# EAGLE design tilt_soms_lgbu_v3 (EAGLE 9.0.1)
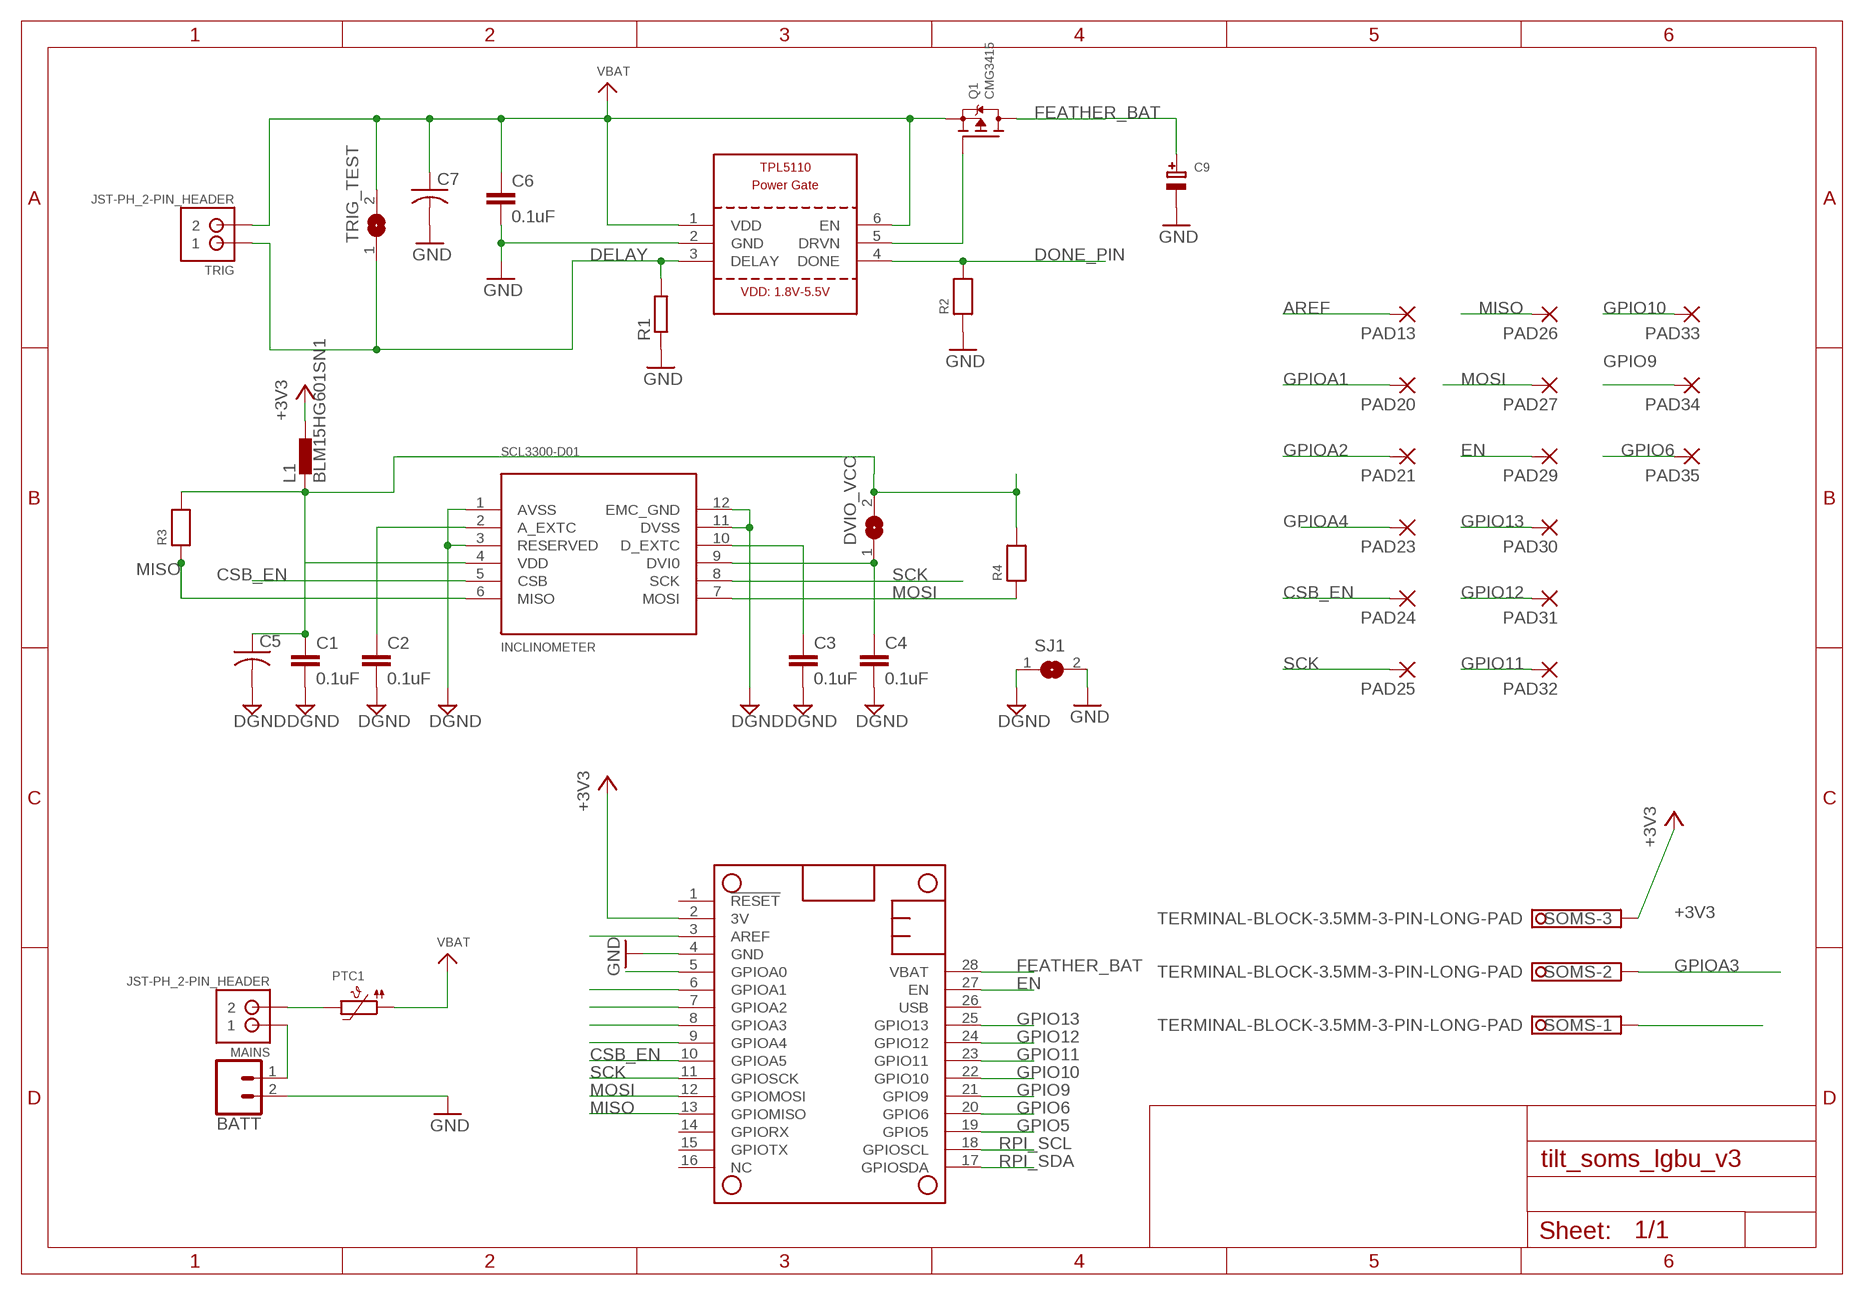
[diagram p0: schematic, sheet 1]

## Parts
BATT  CONN_02POLAR_LOCK  [MOLEX-1X2_LOCK]
C1  0.1uF  C-EUC0402  [C0402]
C2  0.1uF  C-EUC0402  [C0402]
C3  0.1uF  C-EUC0402  [C0402]
C4  0.1uF  C-EUC0402  [C0402]
C5  C-USC1206K  [C1206K]
C6  0.1uF  C-EUC0402  [C0402]
C7  C-USC1206K  [C1206K]
C9  CAP_TANTALUMA/3216_WAVE  [EIA3216-18/A-W]
DVIO_VCC  SOLDERJUMPER  [SOLDERJUMPER_ARROW_NOPASTE]
INCLINOMETER  SCL3300-D01  [SCL3300-D01]
L1  BLM15HG601SN1  [0402]
MAINS  JST-PH_2-PIN_HEADER  [JST_B2B-PH_HEADER]
MS2  FEATHERWINGFEATHERWING_EDC  [FEATHERWING_NODIM_HOLES_2]
PAD13  WIREPADSMD1,27-254  [SMD1,27-2,54]
PAD20  WIREPADSMD1,27-254  [SMD1,27-2,54]
PAD21  WIREPADSMD1,27-254  [SMD1,27-2,54]
PAD23  WIREPADSMD1,27-254  [SMD1,27-2,54]
PAD24  WIREPADSMD1,27-254  [SMD1,27-2,54]
PAD25  WIREPADSMD1,27-254  [SMD1,27-2,54]
PAD26  WIREPADSMD1,27-254  [SMD1,27-2,54]
PAD27  WIREPADSMD1,27-254  [SMD1,27-2,54]
PAD29  WIREPADSMD1,27-254  [SMD1,27-2,54]
PAD30  WIREPADSMD1,27-254  [SMD1,27-2,54]
PAD31  WIREPADSMD1,27-254  [SMD1,27-2,54]
PAD32  WIREPADSMD1,27-254  [SMD1,27-2,54]
PAD33  WIREPADSMD1,27-254  [SMD1,27-2,54]
PAD34  WIREPADSMD1,27-254  [SMD1,27-2,54]
PAD35  WIREPADSMD1,27-254  [SMD1,27-2,54]
PTC1  PTC1210  [PTC1210]
Q1  CMG3415  MOSFET-PWIDE  [SOT23-WIDE]
R1  R-EU_0207/10  [0207/10]
R2  RESISTOR0805  [0805]
R3  RESISTOR0805  [0805]
R4  RESISTOR0805  [0805]
SJ1  SJ  [SJ]
SOMS  TERMINAL-BLOCK-3.5MM-3-PIN-LONG-PAD  [TERMINAL-BLOCK-3-PIN-3.5MM-LONG-PAD]
TIMER  TPL5110  [SOT23-6]
TRIG  JST-PH_2-PIN_HEADER  [JST_B2B-PH_HEADER]
TRIG_TEST  SOLDERJUMPER  [SOLDERJUMPER_ARROW_NOPASTE]

## Nets
+3V3: L1.2 MS2.2(3V) SOMS.3
AREF: MS2.3(AREF) PAD13.1(P)
CSB_EN: INCLINOMETER.5(CSB) MS2.10(GPIOA5) PAD24.1(P)
DELAY: R1.2 TIMER.3(DELAY) TRIG.P1 TRIG_TEST.1
DGND: C1.2 C2.2 C3.2 C4.2 C5.2 INCLINOMETER.1(AVSS) INCLINOMETER.3(RESERVED) INCLINOMETER.11(DVSS) INCLINOMETER.12(EMC_GND) SJ1.1
DONE_PIN: MS2.5(GPIOA0) R2.2 TIMER.4(DONE)
EN: MS2.27(EN) PAD29.1(P)
FEATHER_BAT: C9.+ MS2.28(VBAT) Q1.3(D)
GND: BATT.2 C6.2 C7.2 C9.- MS2.4(GND) R1.1 R2.1 SJ1.2 SOMS.1 TIMER.2(GND)
GPIO5: MS2.19(GPIO5)
GPIO6: MS2.20(GPIO6) PAD35.1(P)
GPIO9: MS2.21(GPIO9) PAD34.1(P)
GPIO10: MS2.22(GPIO10) PAD33.1(P)
GPIO11: MS2.23(GPIO11) PAD32.1(P)
GPIO12: MS2.24(GPIO12) PAD31.1(P)
GPIO13: MS2.25(GPIO13) PAD30.1(P)
GPIOA1: MS2.6(GPIOA1) PAD20.1(P)
GPIOA2: MS2.7(GPIOA2) PAD21.1(P)
GPIOA3: MS2.8(GPIOA3) SOMS.2
GPIOA4: MS2.9(GPIOA4) PAD23.1(P)
MISO: INCLINOMETER.6(MISO) MS2.13(GPIOMISO) PAD26.1(P) R3.1
MOSI: INCLINOMETER.7(MOSI) MS2.12(GPIOMOSI) PAD27.1(P) R4.1
N$1: C2.1 INCLINOMETER.2(A_EXTC)
N$2: C3.1 INCLINOMETER.10(D_EXTC)
N$3: BATT.1 MAINS.P1
N$4: MAINS.P2 PTC1.P$2
N$5: C4.1 DVIO_VCC.1 INCLINOMETER.9(DVI0)
N$6: Q1.1(G) TIMER.5(DRVN)
N$7: C1.1 C5.1 DVIO_VCC.2 INCLINOMETER.4(VDD) L1.1 R3.2 R4.2
RPI_SCL: MS2.18(GPIOSCL)
RPI_SDA: MS2.17(GPIOSDA)
SCK: INCLINOMETER.8(SCK) MS2.11(GPIOSCK) PAD25.1(P)
VBAT: C6.1 C7.1 PTC1.P$1 Q1.2(S) TIMER.1(VDD) TIMER.6(EN) TRIG.P2 TRIG_TEST.2
Unconnected: MS2.1(!RESET) MS2.14(GPIORX) MS2.15(GPIOTX) MS2.16(NC) MS2.26(USB)

## Library data of the parts
BATT = SparkFun-Connectors:CONN_02: Multi connection point. Often used as Generic Header-pin footprint for 0.1 inch spaced/style header connections On any of the 0.1 inch spaced packages, you can populate with these: Break Away Headers - Straight <https://www.sparkfun.com/products/116> (PRT-00116) Break Away Male Headers - Right Angle <https://www.sparkfun.com/products/553> (PRT-00553) Female Headers <https://www.sparkfun.com/products/115> (PRT-00115) Break Away Headers - Machine Pin <https://www.sparkfun.com/products/117> (PRT-00117) Break Away Female Headers - Swiss Machine Pin <https://www.sparkfun.com/products/743> (PRT-00743) For SCREWTERMINALS and SPRING TERMINALS visit here: Screw Terimnals on SparkFun.com <https://www.sparkfun.com/search/results?term=Screw+Terminals> (5mm/3.5mm/2.54mm spacing) This device is also useful as a general connection point to wire up your design to another part of your project. Our various solder wires solder well into these plated through hole pads. Hook-Up Wire - Assortment (Stranded, 22 AWG) <https://www.sparkfun.com/products/11375> (PRT-11375) Hook-Up Wire - Assortment (Solid Core, 22 AWG) <https://www.sparkfun.com/products/11367> (PRT-11367) View the entire wire category on our website here <https://www.sparkfun.com/categories/141> Special notes: Molex polarized connector foot print use with: PRT-08233 with associated crimp pins and housings. 2.54_SCREWTERM for use with PRT-10571. 3.5mm Screw Terminal footprints for PRT-08084 5mm Screw Terminal footprints for use with PRT-08432; SF_ID: PRT-09918
C1-C4 C6 = rcl:C-EU: CAPACITOR, European symbol; SPICEPREFIX: C
C5 C7 = rcl:C-US: CAPACITOR, American symbol
C9 = microbuilder:CAP_TANTALUM: Tantalum Capacitors Wave footprints have larger pads and are meant to be used for hand soldering. Reflow footprints are optimised for solder paste and a reflow oven. EIA3216-18/A-[R/W] - Size A / 3216-18 / 1206 footprint 4.7µF 25V 10% Tantalum Capacitor 10µF 16V 10% Tantalum Capacitor [Digikey: 495-2236-2-ND] EIA3528-21/B-[R/W] - Size B / 3528-21 47µF 10V 10% Tantalum Capactior [Digikey: 495-2216-1-ND] EIA6032-28/C-[R/W] - Size C / 6032-28 10µF 35V 20% Tantalum Capacitor [Digikey: 495-2285-1-ND] 100µF 16V 10% Tantalum Capactior [Digikey: 399-5214-1-ND]
DVIO_VCC TRIG_TEST = microbuilder:SOLDERJUMPER: SMD Solder JUMPER Solder the two pads together to create a connection, or remove the solder to break it. REFLOW - Use this footprint for solder paste and reflow ovens. WAVE - Use this footprint for hand-soldering (larger pads). CLOSED - Has a trace between the two pads to ensure it is closed by default. The trace needs to be cut to disable the jumper, and can be closed again by creating a solder bridge between the two pads.; BOM: EXCLUDE
INCLINOMETER = edc_modules:SCL3300-D01
L1 = inductors:BLM15H: EMIFIL (R) Chip Ferrite Bead for GHz Noise Source: http://www.murata.com/ Ferrite Bead BLM15H.pdf
MAINS TRIG = SRG:JST-PH_2-PIN_HEADER: 2-pin JST PH Shrouded Header, top entry P/N B2B-PH-K-S Mating connector PHR-2 Mating cable assembly: Sparkfun PRT-09914 <http://www.sparkfun.com/products/9914>
MS2 = adafruit:FEATHERWING
PAD13 PAD20 PAD21 PAD23-PAD27 PAD29-PAD35 = wirepad:WIREPAD: Wire PAD connect wire on PCB
PTC1 = microbuilder:PTC: PTC (Resettable Fuse) 1206 Package 250mA PTC (16V Max, Time-to-Trip: 0.08s) - Digikey: F2110CT-ND 1210 Package 100mA PTC (30V Max, Time-to-Trip: 0.6s) - Digikey: MF-USMF010-2CT-ND 1812 Package 750mA PTC (24V Max, Time-to-Trip: 0.2s) - Digikey: MF-MSMF075/24-2CT-ND
Q1 = microbuilder:MOSFET-P: P-Channel Mosfet LEGEND VDS: Voltage Drain-Source ID: Drain Current RDS(ON): Drain-Source On-State Resistance VGS(TH): Gate-Source Threshold Voltage CISS: Drain-Source Input Capacitance SOT-23 Name VDS ID RDS(ON) VGS(TH) CISS Order Number IRLML5103 30V 760mA 600 mOhm -- 75pF @ 25V Digikey: IRLML5103PBFCT-ND IRLML6401 12V 4.3A 50 mOhm 950mV @ 250µA 830pF @ 10V Digikey: IRLML6401PBFTR-ND NTR0202PL 20V 400mA 800 mOhm 2.3V @ 250uA 70pF @ 5V Digikey: NTR0202PLT1GOSTR-ND NTR4101PT1G 20V 1.8A 85 mOhm 1.2V @ 250uA 675pF @ 10V Digikey: NTR4101PT1GOSCT-ND DMP2004K 20V 600mA 900 mOhm 1V @ 250uA 175pF @ 16V Digikey: DMP2004KDICT-ND PMV65XP 20V 3.9A 76 mOhm 950mV @ 1mA 725pF @ 20V Digikey: 568-2358-2-ND TO-252 Name VDS ID RDS(ON) VGS(TH) CISS Order Number AOD417 30V 25A 34 mOhm 3V @ 250µA 920pF @ 15V Digikey: 785-1106-2-ND
R1 = rcl:R-EU_: RESISTOR, European symbol
R2-R4 = microbuilder:RESISTOR: Resistors 0402 - 0402 Surface Mount Package 22 Ohm 1% 1/16W [Digikey: 311-22.0LRTR-ND] 33 Ohm 5% 1/16W 1.0K 5% 1/16W 1.5K 5% 1/16W 2.0K 1% 1/16W 10.0K 1% 1/16W [Digikey: 311-10.0KLRTR-ND] 10.0K 5% 1/16W [Digikey: RMCF0402JT10K0TR-ND] 12.1K 1% 1/16W [Digikey: 311-22.0LRTR-ND] 100.0K 5% 1/16W 0603 - 0603 Surface Mount Package 0 Ohm 1/10 Watt 1% Resistor 15 Ohm 1/10 Watt 1% Resistor 33 Ohm 1/10 Watt 1% Resistor 49.9 Ohm 1/10 Watt 1% Resistor 100 Ohm 1/10 Watt 1% Resistor 150 Ohm 1/10 Watt 1% Resistor 240 Ohm 1/10 Watt 1% Resistor 390 Ohm 1/10 Watt 1% Resistor 560 Ohm 1/10 Watt 1% Resistor 680 Ohm 1/10 Watt 1% Resistor 750 Ohm 1/10 Watt 1% Resistor 1.0K Ohm 1/10 Watt 1% Resistor 1.5K Ohm 1/10 Watt 1% Resistor 2.0K Ohm 1/10 Watt 1% Resistor 2.2K Ohm 1/10 Watt 1% Resistor 3.3K Ohm 1/10 Watt 1% Resistor 4.7K Ohm 1/10 Watt 1% Resistor 10.0K Ohm 1/10 Watt 1% Resistor 12.0K Ohm 1/10 Watt 1% Resistor 12.1K Ohm 1/10 Watt 1% Resistor 20.0K Ohm 1/10 Watt 1% Resistor 33.0K Ohm 1/10 Watt 1% Resistor 100.0K Ohm 1/10 Watt 1% Resistor 0805 - 0805 Surface Mount Package 0 Ohm 1/8 Watt 1% Resistor 33 Ohm 1/8 Watt 1% Resistor 100 Ohm 1/8 Watt 1% Resistor 150 Ohm 1/8 Watt 1% Resistor 200 Ohm 1/8 Watt 1% Resistor 240 Ohm 1/8 Watt 1% Resistor 330 Ohm 1/8 Watt 1% Resistor 390 Ohm 1/8 Watt 1% Resistor 470 Ohm 1/8 Watt 1% Resistor 1.0K Ohm 1/8 Watt 1% Resistor 1.5K Ohm 1/8 Watt 1% Resistor 2.0K Ohm 1/8 Watt 1% Resistor 4.7K Ohm 1/8 Watt 1% Resistor 5.1K Ohm 1/8 Watt 1% Resistor 5.6K Ohm 1/8 Watt 1% Resistor 10.0K Ohm 1/8 Watt 1% Resistor 22.0K Ohm 1/8 Watt 1% Resistor 33.0K Ohm 1/8 Watt 1% Resistor 100K Ohm 1/8 Watt 1% Resistor 1206 - 1206 Surface Mount Package 2012 - 2010 Surface Mount Package 0.11 Ohm 1/2 Watt 1% Resistor - Digikey: RHM.11UCT-ND
SJ1 = jumper:SJ: SMD solder JUMPER
SOMS = Rembrandt Electronics - Terminal Block 3-5mm v1-0:TERMINAL-BLOCK-3.5MM-3-PIN: Terminal Block 3.5mm Pitch: 3,5 mm Number of pins: 3 Created by Rembrandt Electronics www.rembrandtelectronics.com
TIMER = edc_modules:TPL5110

## Board
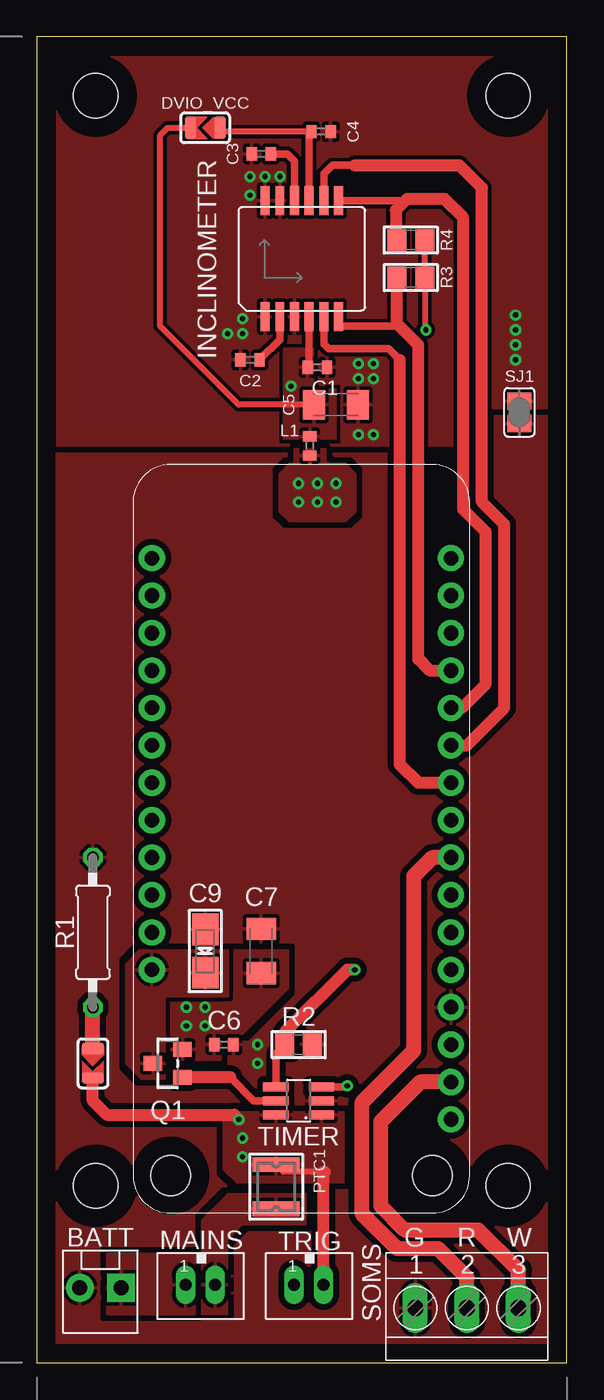
[diagram p1: board, top side]
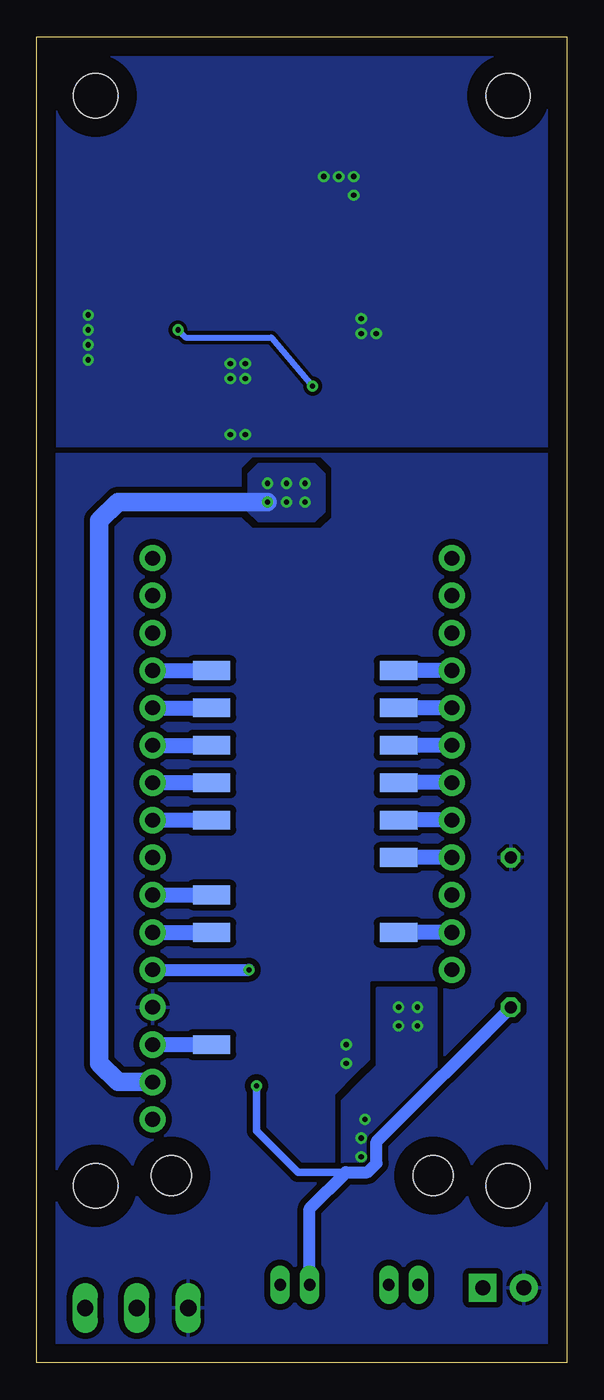
[diagram p2: board, bottom side, seen from below]

Size 36 x 90 mm. Coordinates in mm from the lower left corner, seen from the top.
Outline: 36,90 0,90 0,0 36,0 36,90
Copper layers (1*16): Top 0.035mm / dielectric 1.5mm / Bottom 0.035mm
Design rules "default *": minimum track width 8mil, minimum drill 0.35mm, track to track 10mil, track to pad 10mil, pad to pad 10mil, via to via 10mil, smd to smd 6mil, copper to edge 50mil, drill to drill 10mil, minimum pad ring 10mil, minimum via ring 8mil, stop-mask expansion 4mil, vias tented up to drill 0mil, thermal gap 10mil
Holes 3 mm at 32,12 4,12 32,86 4,86

### Footprints (pad centres in the part's own frame; a part is rotated, then mirrored left to right if it is on the bottom)
MOLEX-1X2_LOCK = drill 1.016 pad 1.88 square: 1 -0.127,0 | drill 1.016 pad 1.88: 2 2.667,0
C0402 = smd 0.7 x 0.9: 1 -0.65,0; 2 0.65,0
C1206K = smd 1.5 x 2: 1 -1.5,0; 2 1.5,0
EIA3216-18/A-W = smd 2.15 x 1.8: + 1.475,0; - -1.475,0
SOLDERJUMPER_ARROW_NOPASTE = smd 0.762 x 1.524: 1 -1.016,0; 2 1.016,0
SCL3300-D01 = smd 0.61 x 1.96: 1 -2.5,-3.935; 2 -1.5,-3.935; 3 -0.5,-3.935; 4 0.5,-3.935; 5 1.5,-3.935; 6 2.5,-3.935; 7 2.5,3.935; 8 1.5,3.935; 9 0.5,3.935; 10 -0.5,3.935; 11 -1.5,3.935; 12 -2.5,3.935
0402 = smd 0.7 x 0.9: 1 -0.65,0; 2 0.65,0
JST_B2B-PH_HEADER = drill 0.8 long: P1 1.075,0.048; P2 -0.925,0.048
FEATHERWING_NODIM_HOLES_2 = drill 1 pad 1.778: 1 6.35,1.27; 2 8.89,1.27; 3 11.43,1.27; 4 13.97,1.27; 5 16.51,1.27; 6 19.05,1.27; 7 21.59,1.27; 8 24.13,1.27; 9 26.67,1.27; 10 29.21,1.27; 11 31.75,1.27; 12 34.29,1.27; 13 36.83,1.27; 14 39.37,1.27; 15 41.91,1.27; 16 44.45,1.27; 17 44.45,21.59; 18 41.91,21.59; 19 39.37,21.59; 20 36.83,21.59; 21 34.29,21.59; 22 31.75,21.59; 23 29.21,21.59; 24 26.67,21.59; 25 24.13,21.59; 26 21.59,21.59; 27 19.05,21.59; 28 16.51,21.59 | hole 2.7: 2.54,20.32; 2.54,2.54
SMD1,27-2,54 = smd 1.27 x 2.54: 1 0,0
PTC1210 = smd 1 x 3.2: P$1 -1.5,0; P$2 1.5,0
SOT23-WIDE = smd 1 x 1.27: 1 -0.95,-1; 2 0.95,-1; 3 0,1
0207/10 = drill 0.813 octagon: 1 -5.08,0; 2 5.08,0
0805 = smd 1.3 x 1.5: 1 -0.95,0; 2 0.95,0
SJ = smd 1.168 x 1.6: 1 -0.762,0; 2 0.762,0
TERMINAL-BLOCK-3-PIN-3.5MM-LONG-PAD = drill 1.1 pad 1.7 long: 1 -3.5,-0.1; 2 0,-0.1; 3 3.5,-0.1
SOT23-6 = smd 0.6 x 1.7: 1 -0.95,-1.55; 2 0,-1.55; 3 0.95,-1.55; 4 0.95,1.55; 5 0,1.55; 6 -0.95,1.55

### Placement (x,y rotation side)
BATT  5.59,5.08 180 top
C1  19.05,67.56 0 top
C2  14.48,68.07 180 top
C3  15.24,82.04 180 top
C4  19.3,83.57 0 top
C5  20.32,65.02 0 top
C6  12.7,21.59 0 top
C7  15.24,27.94 90 top
C9  11.43,27.94 270 top
DVIO_VCC  11.43,83.82 180 top
INCLINOMETER  18,74.93 0 top
L1  18.54,62.23 270 top
MAINS  11.18,5.33 180 top
MS2  29.4,10.16 90 top
PAD13  24.13,21.59 270 bottom
PAD20  24.13,29.21 90 bottom
PAD21  24.13,31.75 90 bottom
PAD23  24.13,36.83 90 bottom
PAD24  24.13,39.37 90 bottom
PAD25  24.13,41.91 90 bottom
PAD26  24.13,46.99 90 bottom
PAD27  24.13,44.45 90 bottom
PAD29  11.43,29.21 90 bottom
PAD30  11.43,34.29 90 bottom
PAD31  11.43,36.83 90 bottom
PAD32  11.43,39.37 90 bottom
PAD33  11.43,41.91 90 bottom
PAD34  11.43,44.45 90 bottom
PAD35  11.43,46.99 90 bottom
PTC1  16.26,11.94 270 top
Q1  8.89,20.32 90 top
R1  3.81,29.21 270 top
R2  17.78,21.59 180 top
R3  25.4,73.66 0 top
R4  25.4,76.2 0 top
SJ1  32.77,64.52 270 top
SOMS  29.21,3.81 0 top
TIMER  17.78,17.78 90 top
TRIG  18.54,5.33 180 top
TRIG_TEST  3.81,20.32 270 top

### Tracks (layer width: path | path; a pad name or v marks a point on that pad's centre or on a via)
+3V3  (via drill 0.35)
  Top 1.016: SOMS.3 32.71,6.29 30,9 25,9 23.36,10.63 23.36,16.36 26.05,19.05 MS2.2
  Bottom 1.27: MS2.2 30.48,19.05 31.75,20.32 31.75,57.15 30.48,58.42 27.69,58.42 v20.32,58.42
  other vias: 20.32,59.69 19.05,59.69 19.05,58.42 17.78,59.69 17.78,58.42
  pour Top: 20.95,57.15 17.14,57.15 16.51,57.78 16.51,60.33 17.14,60.96 17.53,60.96 17.53,61.98 18.98,61.98 19.56,61.98 19.56,61.21 19.81,60.96 20.95,60.96 21.59,60.33 21.59,57.78
  pour Bottom: 20.95,57.15 17.14,57.15 16.51,57.78 16.51,60.33 17.14,60.96 20.95,60.96 21.59,60.33 21.59,57.78
AREF
  Bottom 1.016: MS2.3 PAD13.1
CSB_EN
  Top 0.406: INCLINOMETER.5 19.5,70.16
  Top 0.508: 19.5,70.16 19.5,69.15 19.81,68.83 23.88,68.83 24.64,68.07
  Top 0.813: MS2.10 25.91,39.37 24.64,40.64 24.64,68.07
  Bottom 1.016: MS2.10 PAD24.1
DELAY  (via drill 0.35)
  Top 0.508: TIMER.3 21.02,18.73 v21.08,18.8
  Top 1.016: TRIG_TEST.1 R1.2
  Bottom 0.508: 15.01,12.93 18.27,12.93 21.08,15.75 v21.08,18.8
  Bottom 0.813: TRIG.P1 17.47,10.47 15.01,12.93 13.54,12.93 12.93,13.54 12.93,15.01 R1.2
DGND  (via drill 0.35)
  other vias: 13.97,69.85 12.95,69.85 13.97,70.87 21.84,67.82 22.86,67.82 21.84,66.8 22.86,66.8 32.51,71.12 32.51,68.07 32.51,69.09 32.51,70.1 16.51,80.52 15.49,80.52 14.48,80.52 14.48,79.25 21.84,62.99 22.86,62.99
  pour Bottom (rank 3): 1.27,88.9 34.8,88.9 34.8,62.23 1.27,62.23
  pour Top (rank 3): 34.8,64.77 30.48,64.77 30.48,62.23 1.27,62.23 1.27,88.9 34.8,88.9
DONE_PIN  (via drill 0.35)
  Top 0.508: 16.63,21.39 R2.2 16.23,20.99 TIMER.4
  Top 0.813: R2.2 16.83,22.42 21.08,26.67 v21.59,26.67
  Bottom 0.813: MS2.5 v21.59,26.67
EN
  Bottom 1.016: MS2.27 PAD29.1
FEATHER_BAT
  pour Top: 12.95,27.94 12.95,24.89 8.64,24.89 8.64,19.3 7.11,19.3 6.1,20.32 6.1,27.05 6.99,27.94
GND  (via drill 0.35)
  other vias: 14.99,20.32 14.99,21.59
  pour Bottom (isolate 0.406, rank 6): 36,90 0,90 0,0 36,0
  pour Top (isolate 0.406, rank 6): 36,90.06 0,90 0,0 36,0
GPIO6
  Bottom 1.016: MS2.20 PAD35.1
GPIO9
  Bottom 1.016: MS2.21 PAD34.1
GPIO10
  Bottom 1.016: MS2.22 PAD33.1
GPIO11
  Bottom 1.016: MS2.23 PAD32.1
GPIO12
  Bottom 1.016: MS2.24 PAD31.1
GPIO13
  Bottom 1.016: MS2.25 PAD30.1
GPIOA1
  Bottom 1.016: MS2.6 PAD20.1
GPIOA2
  Bottom 1.016: MS2.7 PAD21.1
GPIOA3
  Top 1.016: SOMS.2 29.21,5.79 27.27,7.73 24.47,7.73 22.09,10.11 22.09,17.67 25.59,21.17 25.59,33.02 26.86,34.29 MS2.8
GPIOA4
  Bottom 1.016: MS2.9 PAD23.1
MISO
  Top 0.406: R3.1 24.45,71.19 | 20.57,70.36 20.5,70.43 INCLINOMETER.6
  Top 0.508: 20.57,70.36 24.26,70.36 24.45,70.55
  Top 0.813: MS2.13 26.67,46.99 25.91,47.75 25.91,69.09 24.45,70.55 R3.1
  Bottom 1.016: MS2.13 PAD26.1
MOSI
  Top 0.406: INCLINOMETER.7 20.5,78.92
  Top 0.508: INCLINOMETER.7 25.02,78.86 25.15,78.99
  Top 0.813: MS2.12 28.86,44.45 30.48,46.07 30.48,56.39 28.96,57.91 28.96,77.72 27.69,78.99 25.15,78.99 24.38,78.23 24.38,76.27 R4.1
  Bottom 1.016: MS2.12 PAD27.1
N$1
  Top 0.508: INCLINOMETER.2 16.5,69.44 C2.1
N$2
  Top 0.508: INCLINOMETER.10 17.5,81.56 17.02,82.04 C3.1
N$3
  pour Top (rank 2): 4.83,7.37 10.67,7.37 10.67,3.3 4.83,3.3
N$4
  pour Top: 11.18,3.3 12.95,3.3 12.95,8.38 13.97,9.4 18.29,9.4 18.29,11.43 12.95,11.43 11.18,9.65
N$5
  Top 0.406: C4.1 12.7,83.57 DVIO_VCC.1
  Top 0.508: INCLINOMETER.9 18.5,83.41 C4.1
N$6
  Top 0.508: TIMER.5 14.73,17.78 13.14,19.37
  Top 0.813: 13.14,19.37 Q1.1
N$7  (via drill 0.35)
  Top 0.406: R4.2 R3.2 26.35,70.17 v26.42,70.1 | C5.1 13.72,65.02 8.38,70.36 8.38,83.31 8.89,83.82 DVIO_VCC.2 10.67,83.57
  Top 0.508: INCLINOMETER.4 18.5,67.66 C1.1
  Bottom 0.406: v26.42,70.1 25.91,69.6 20.07,69.6 v17.27,66.29
  pour Top: 16.76,62.74 20.32,62.74 20.32,66.04 18.8,66.04 18.8,68.83 16.76,68.83
SCK
  Top 0.508: INCLINOMETER.8 19.5,80.71 20.07,81.28 21.59,81.28
  Top 0.813: 21.59,81.28 28.7,81.28 30.23,79.76 30.23,58.42 31.75,56.9 31.75,44.45 29.21,41.91 MS2.11
  Bottom 1.016: MS2.11 PAD25.1
VBAT  (via drill 0.35)
  Top 0.406: 19.47,12.95 16.74,12.95 PTC1.P$1
  Top 0.813: TRIG_TEST.2 3.81,17.78 4.76,16.83 13.4,16.83 v13.72,16.51 | TRIG.P2 19.47,12.86 19.56,12.95 19.47,12.95
  other vias: 10.16,22.86 11.43,22.86 13.97,15.24 13.97,13.97 10.16,24.13 11.43,24.13
  pour Top: 20.83,12.19 13.59,12.19 12.7,13.08 12.7,17.02 20.83,17.02
  pour Top (rank 2): 14.48,27.94 17.02,27.94 17.02,25.4 13.97,22.35 12.45,22.35 12.45,20.57 9.14,20.57 9.14,24.38 12.7,24.38 13.46,25.15 13.46,27.94
  pour Bottom: 8.89,25.4 12.88,25.4 12.88,20.14 13.97,19.05 15.24,17.78 15.24,12.7 8.89,12.7

### Text on the board
tPlace: G | R | W
tDocu: Tilt and Soil Moisture Board v3